# EAGLE design sx19_project_02_air_quality (EAGLE 9.6.2)
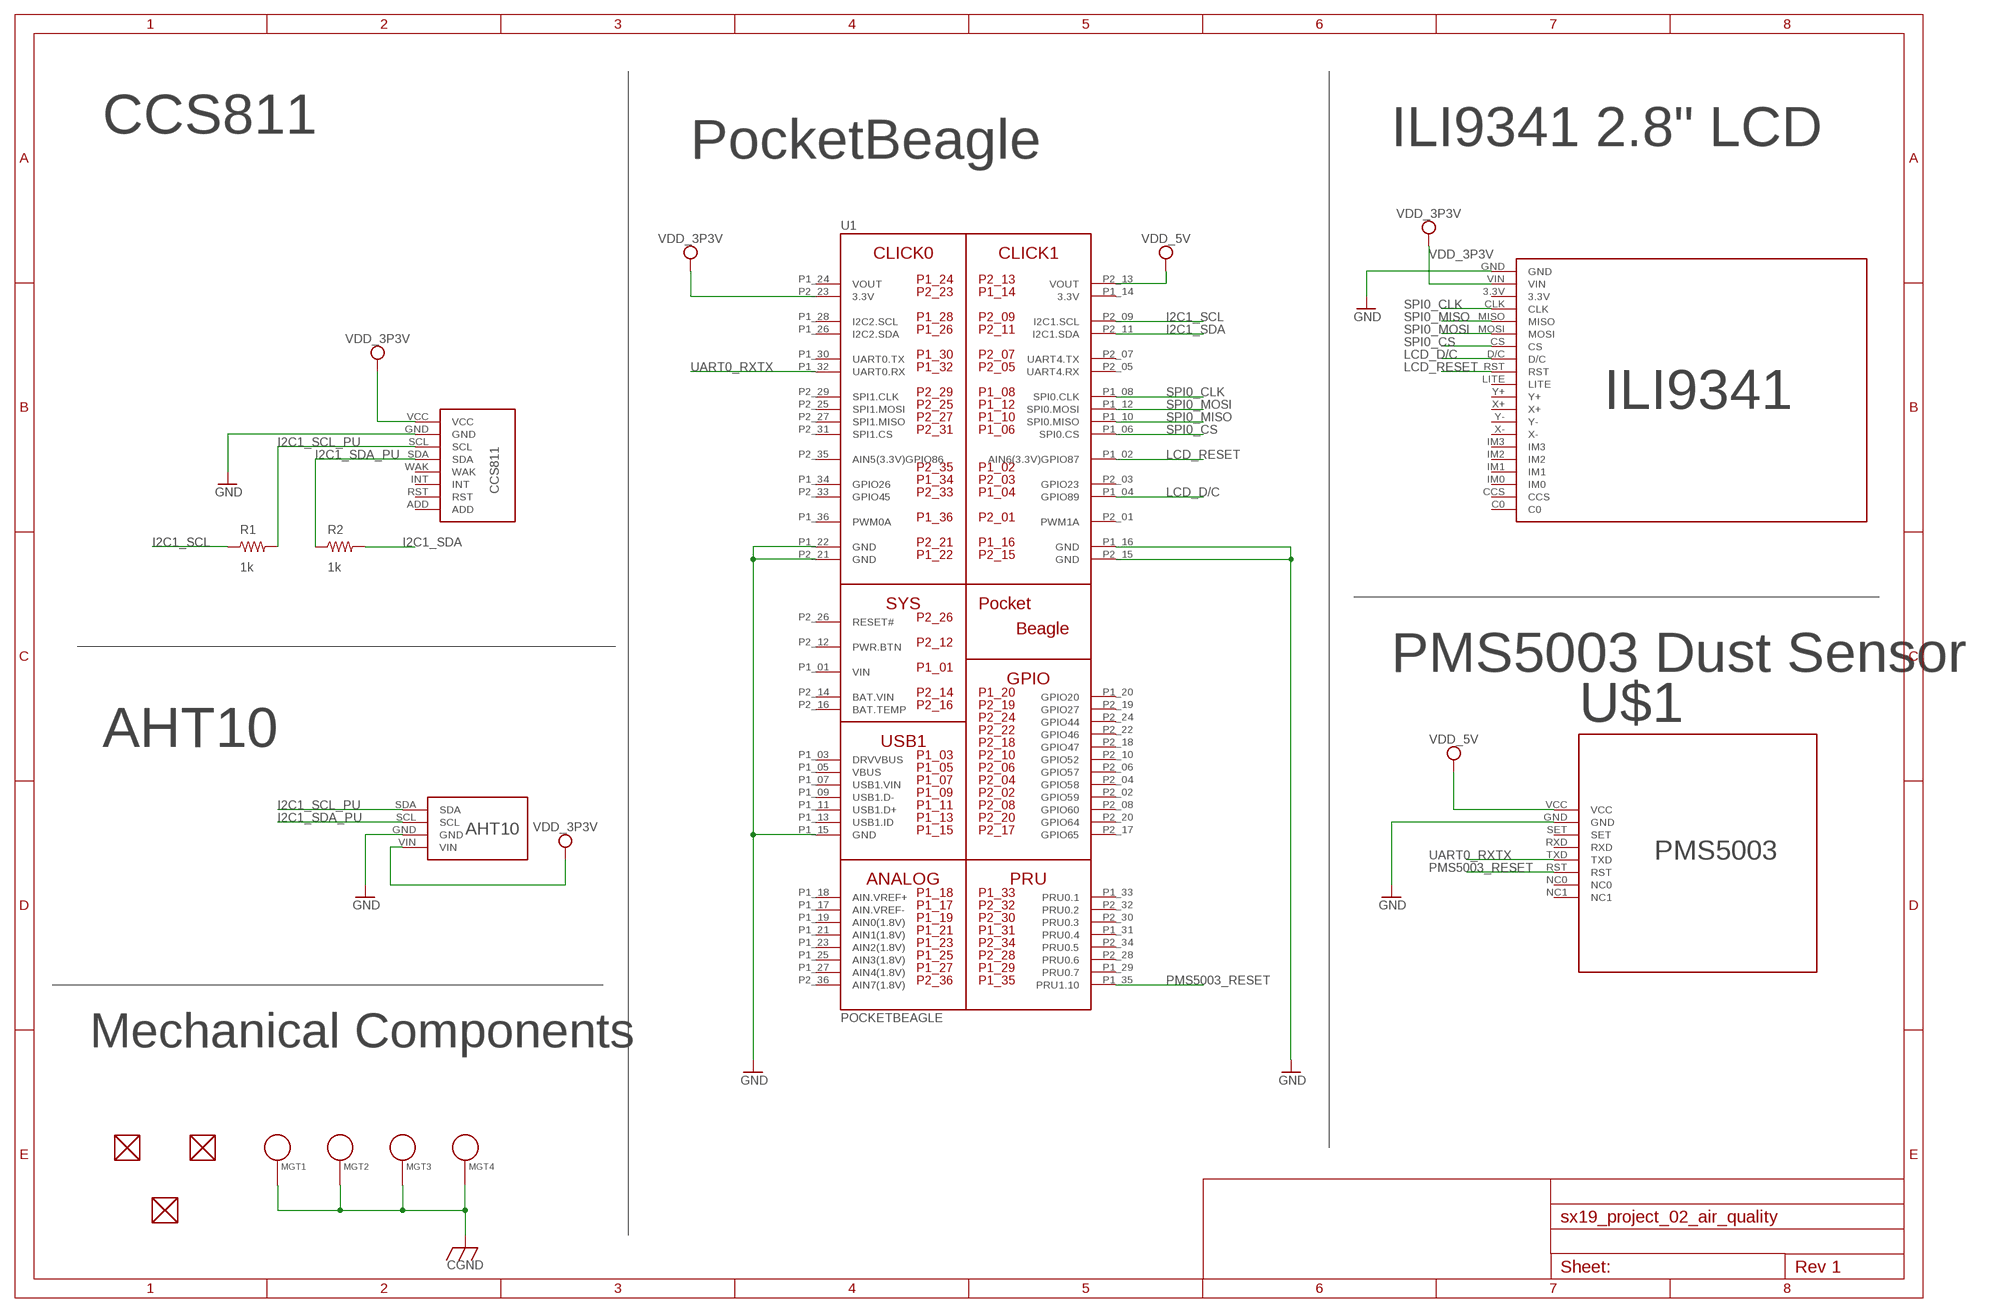
[diagram p0: schematic, sheet 1]

## Parts
B1  AHT10  [AHT10]
B2  CCS811  [CCS811]
B3  ILI9341  [ILI9341]
FUD1  FIDUCIAL  [FIDUCIAL_40MIL]
FUD2  FIDUCIAL  [FIDUCIAL_40MIL]
FUD3  FIDUCIAL  [FIDUCIAL_40MIL]
MGT1  MOUNTING_HOLE  [MOUNTING_HOLE]
MGT2  MOUNTING_HOLE  [MOUNTING_HOLE]
MGT3  MOUNTING_HOLE  [MOUNTING_HOLE]
MGT4  MOUNTING_HOLE  [MOUNTING_HOLE]
R1  1k  R_R0603  [R0603]
R2  1k  R_R0603  [R0603]
U1  POCKETBEAGLE  [POCKETBEAGLE]
U$1  PMS5003  [PMS5003]

## Nets
CGND: MGT1.P$1 MGT2.P$1 MGT3.P$1 MGT4.P$1
GND: B1.GND B2.GND B3.GND U1.P1_15(GND) U1.P1_16(GND) U1.P1_22(GND) U1.P2_15(GND) U1.P2_21(GND) U$1.GND
I2C1_SCL: R1.1 U1.P2_09(I2C1.SCL)
I2C1_SCL_PU: B1.SDA B2.SCL R1.2
I2C1_SDA: R2.2 U1.P2_11(I2C1.SDA)
I2C1_SDA_PU: B1.SCL B2.SDA R2.1
LCD_D/C: B3.D/C U1.P1_04(GPIO89)
LCD_RESET: B3.RST U1.P1_02(AIN6(3.3V)GPIO87)
PMS5003_RESET: U1.P1_35(PRU1.10) U$1.RST
SPI0_CLK: B3.CLK U1.P1_08(SPI0.CLK)
SPI0_CS: B3.CS U1.P1_06(SPI0.CS)
SPI0_MISO: B3.MISO U1.P1_10(SPI0.MISO)
SPI0_MOSI: B3.MOSI U1.P1_12(SPI0.MOSI)
UART0_RXTX: U1.P1_32(UART0.RX) U$1.TXD
VDD_3P3V: B1.VIN B2.VCC B3.VIN U1.P2_23(3.3V)
VDD_5V: U1.P2_13(VOUT) U$1.VCC
Unconnected: B2.ADD B2.INT B2.RST B2.WAK B3.3.3V B3.C0 B3.CCS B3.IM0 B3.IM1 B3.IM2 B3.IM3 B3.LITE B3.X+ B3.X- B3.Y+ B3.Y- FUD1.P$1 FUD2.P$1 FUD3.P$1 U1.P1_03(DRVVBUS) U1.P1_05(VBUS) U1.P1_07(USB1.VIN) U1.P1_09(USB1.D-) U1.P1_11(USB1.D+) U1.P1_13(USB1.ID) U1.P1_17(AIN.VREF-) U1.P1_18(AIN.VREF+) U1.P1_19(AIN0(1.8V)) U1.P1_20(GPIO20) U1.P1_21(AIN1(1.8V)) U1.P1_23(AIN2(1.8V)) U1.P1_25(AIN3(1.8V)) U1.P1_26(I2C2.SDA) U1.P1_27(AIN4(1.8V)) U1.P1_28(I2C2.SCL) U1.P1_29(PRU0.7) U1.P1_30(UART0.TX) U1.P1_31(PRU0.4) U1.P1_33(PRU0.1) U1.P1_34(GPIO26) U1.P1_36(PWM0A) U1.P2_01(PWM1A) U1.P2_02(GPIO59) U1.P2_03(GPIO23) U1.P2_04(GPIO58) U1.P2_05(UART4.RX) U1.P2_06(GPIO57) U1.P2_07(UART4.TX) U1.P2_08(GPIO60) U1.P2_10(GPIO52) U1.P2_12(PWR.BTN) U1.P2_16(BAT.TEMP) U1.P2_17(GPIO65) U1.P2_18(GPIO47) U1.P2_19(GPIO27) U1.P2_20(GPIO64) U1.P2_22(GPIO46) U1.P2_24(GPIO44) U1.P2_25(SPI1.MOSI) U1.P2_26(RESET#) U1.P2_27(SPI1.MISO) U1.P2_28(PRU0.6) U1.P2_29(SPI1.CLK) U1.P2_30(PRU0.3) U1.P2_31(SPI1.CS) U1.P2_32(PRU0.2) U1.P2_33(GPIO45) U1.P2_34(PRU0.5) U1.P2_35(AIN5(3.3V)GPIO86) U1.P2_36(AIN7(1.8V)) U$1.NC0 U$1.NC1 U$1.RXD U$1.SET

## Notes on the sheet
- CCS811 | ILI9341 2.8" LCD
- PocketBeagle
- PMS5003 Dust Sensor
- AHT10
- Mechanical Components

## Power pins joined to a net without a drawn wire
3.3V: U1.P1_14(3.3V)
BAT.VIN: U1.P2_14(BAT.VIN)
VIN: U1.P1_01(VIN)
VOUT: U1.P1_24(VOUT)

## Library data of the parts
B1 = project_02_lib:AHT10: Breakout board for the AHT10 integrated temperature and humidity sensor by Aosong (Asair) Electronics
B2 = project_02_lib:CCS811: CCS811 based a specific layout sold on Amazon. May be discontinued in favor of the Adafruit design.
B3 = project_02_lib:ILI9341: ILI9341 LCD based on the 2.8" Adafruit product
FUD1-FUD3 = project_02_lib:FIDUCIAL
MGT1-MGT4 = project_02_lib:MOUNTING_HOLE: Chassis Mounting Hole w/GND connection ability
R1 R2 = project_02_lib:R_: RESISTOR, American symbol
U1 = project_02_lib:POCKETBEAGLE
U$1 = project_02_lib:PMS5003: Breakout board of the PMS5003 by Plantower and distributed by Adafruit. Connects to the corresponding terminals on the PMS5003 dust sensor.

## Board
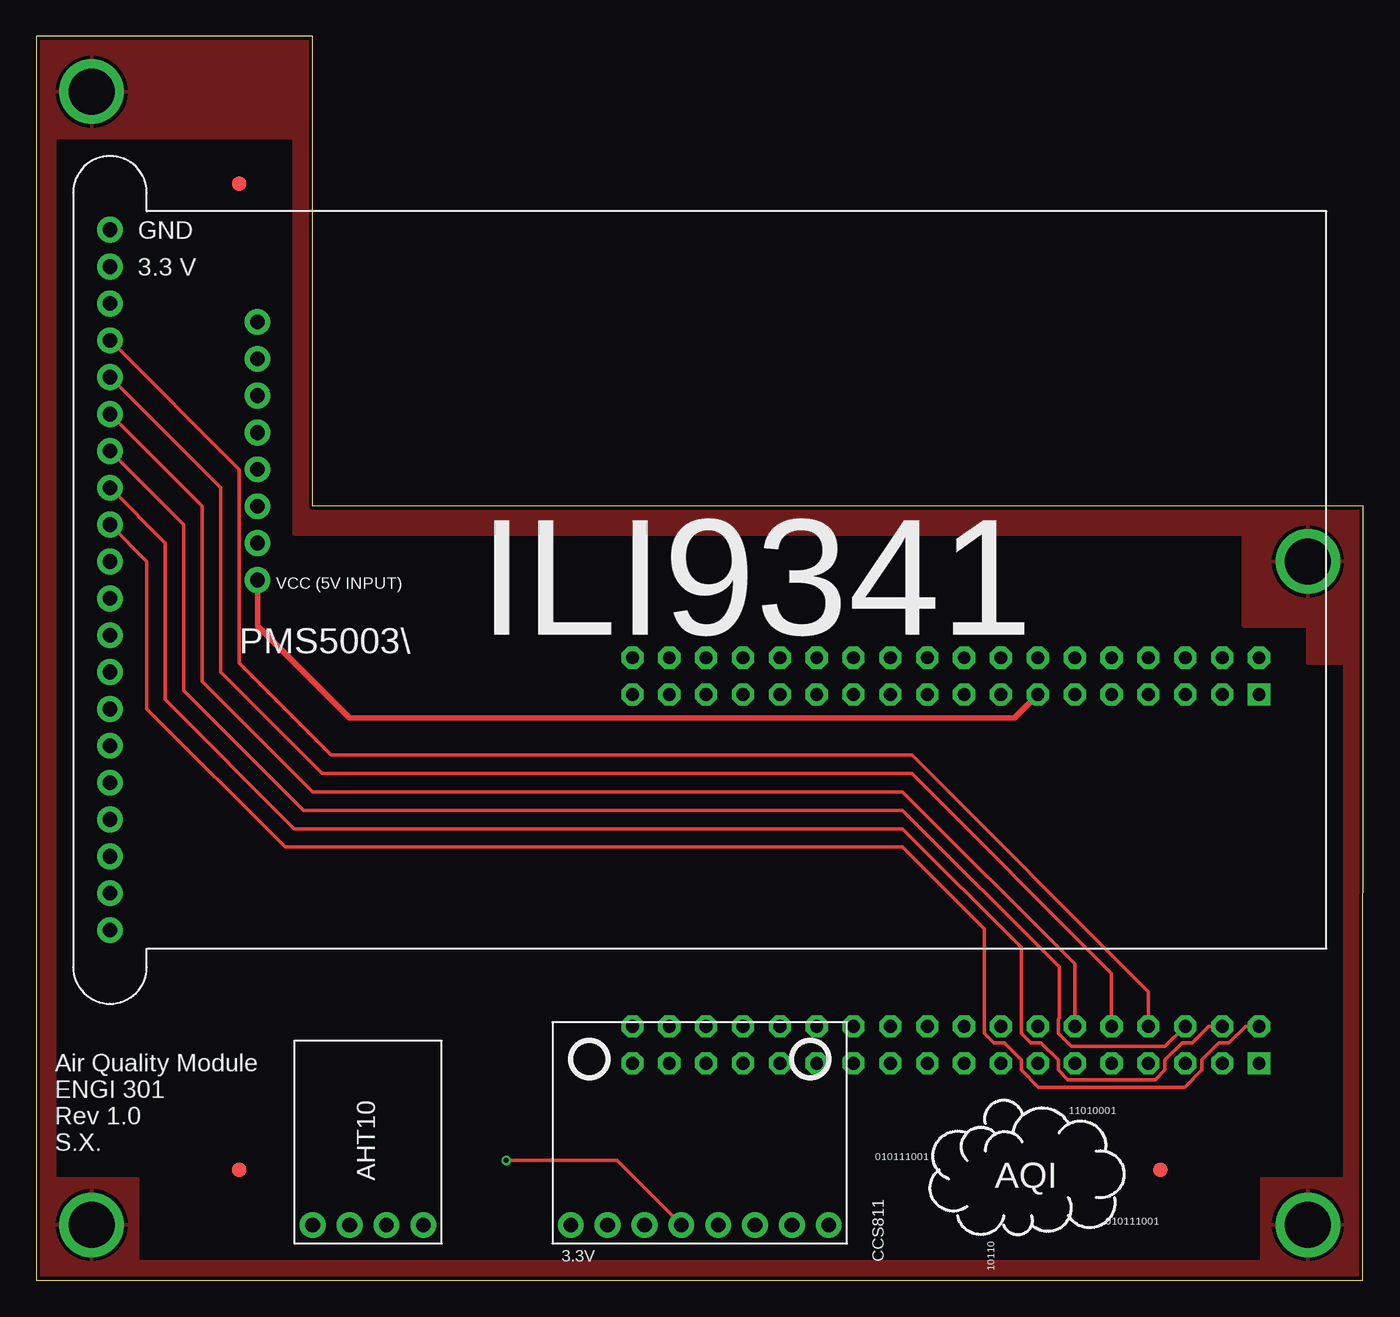
[diagram p1: board, top side]
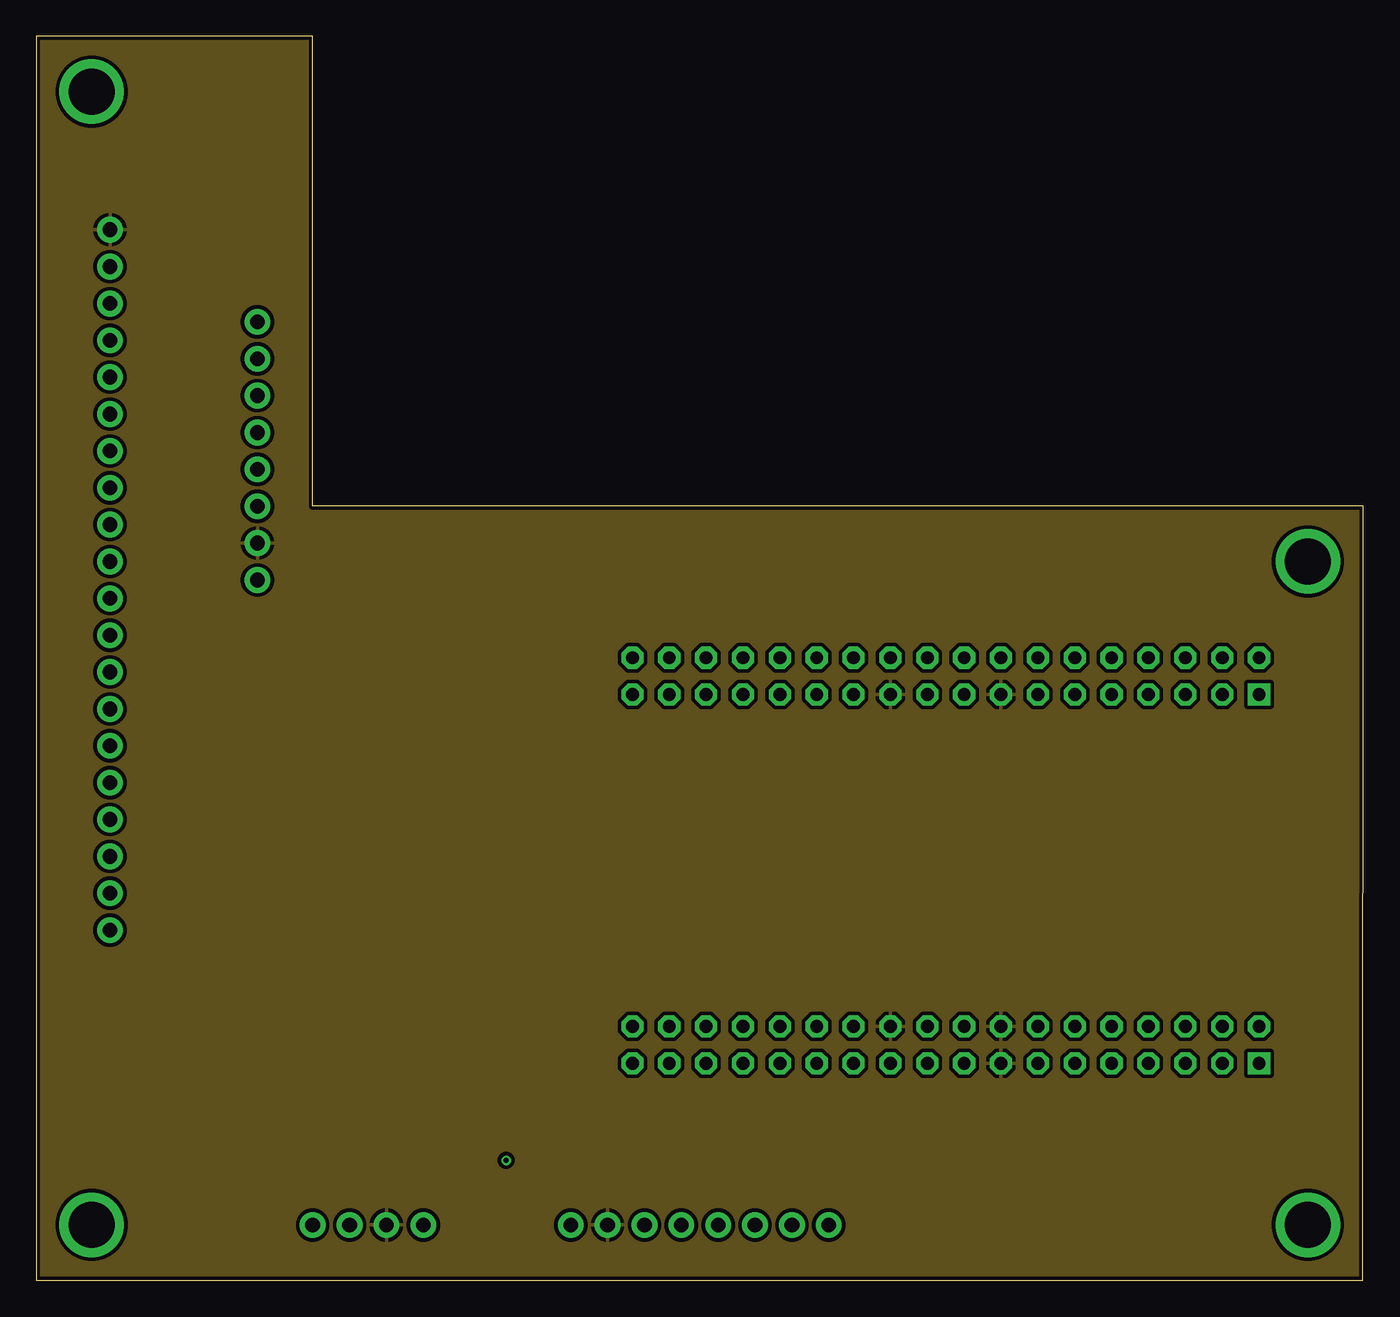
[diagram p2: board, inner layer Route2]
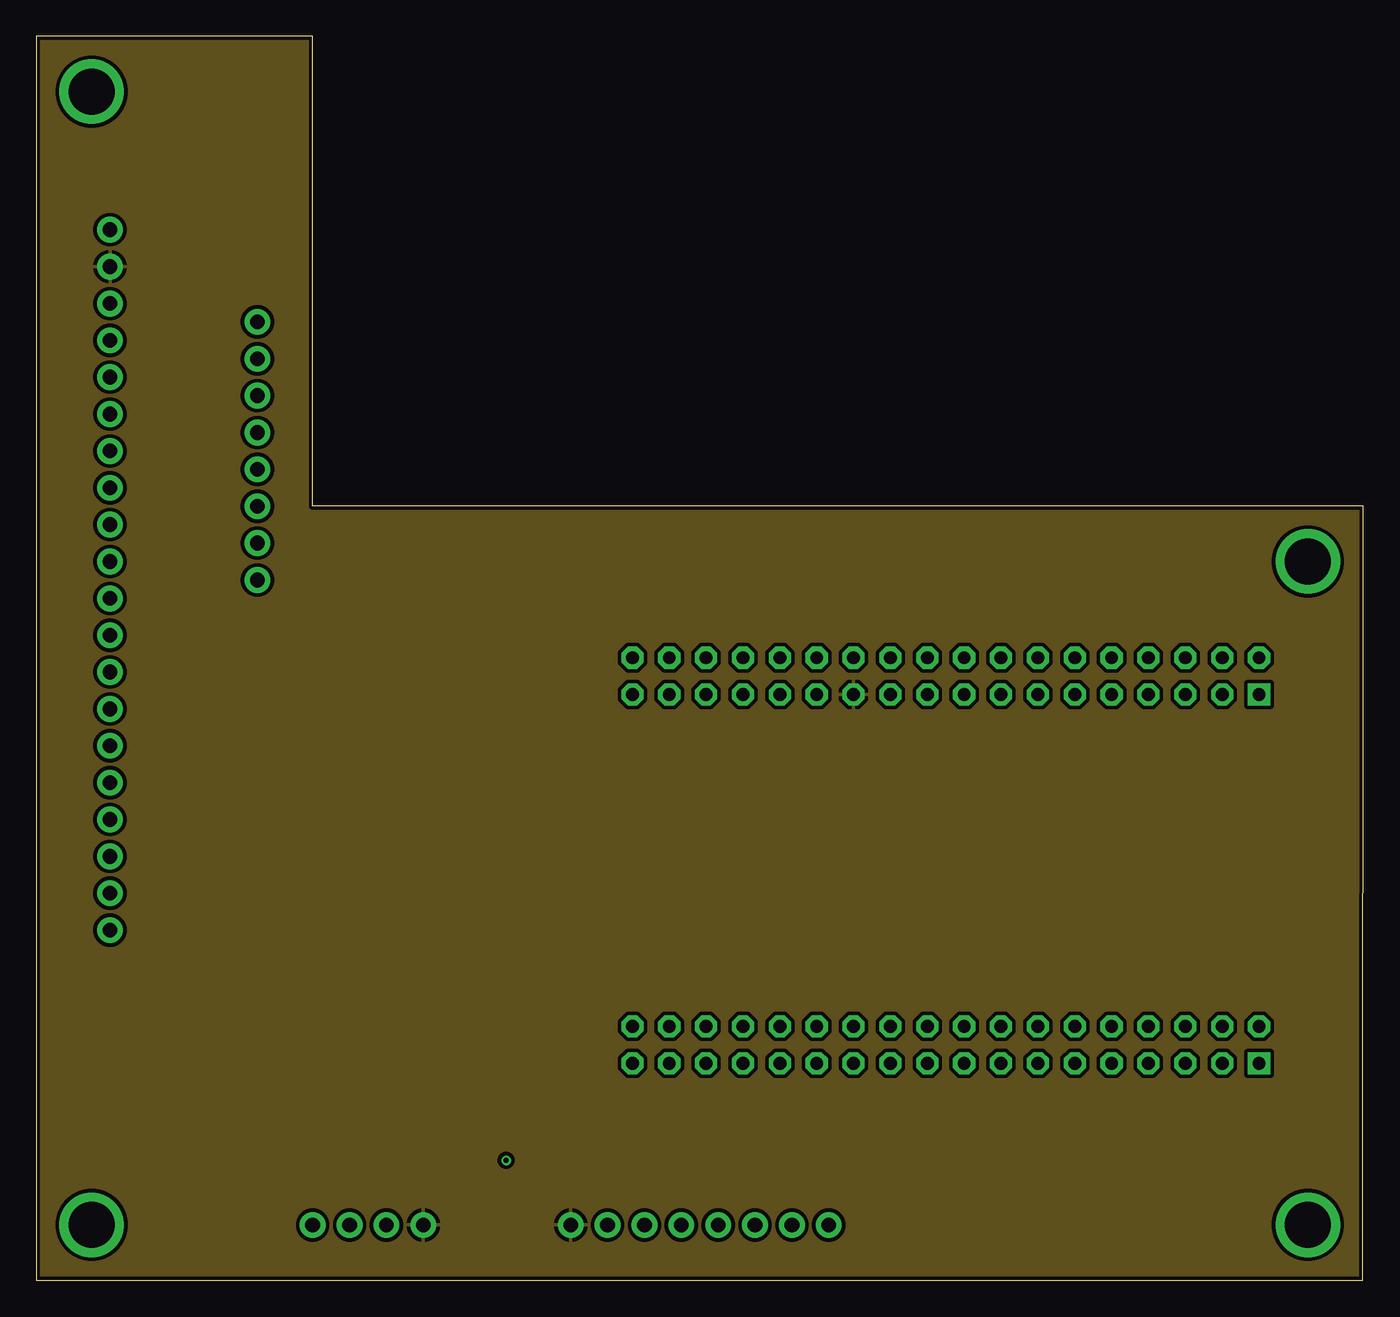
[diagram p3: board, inner layer Route15]
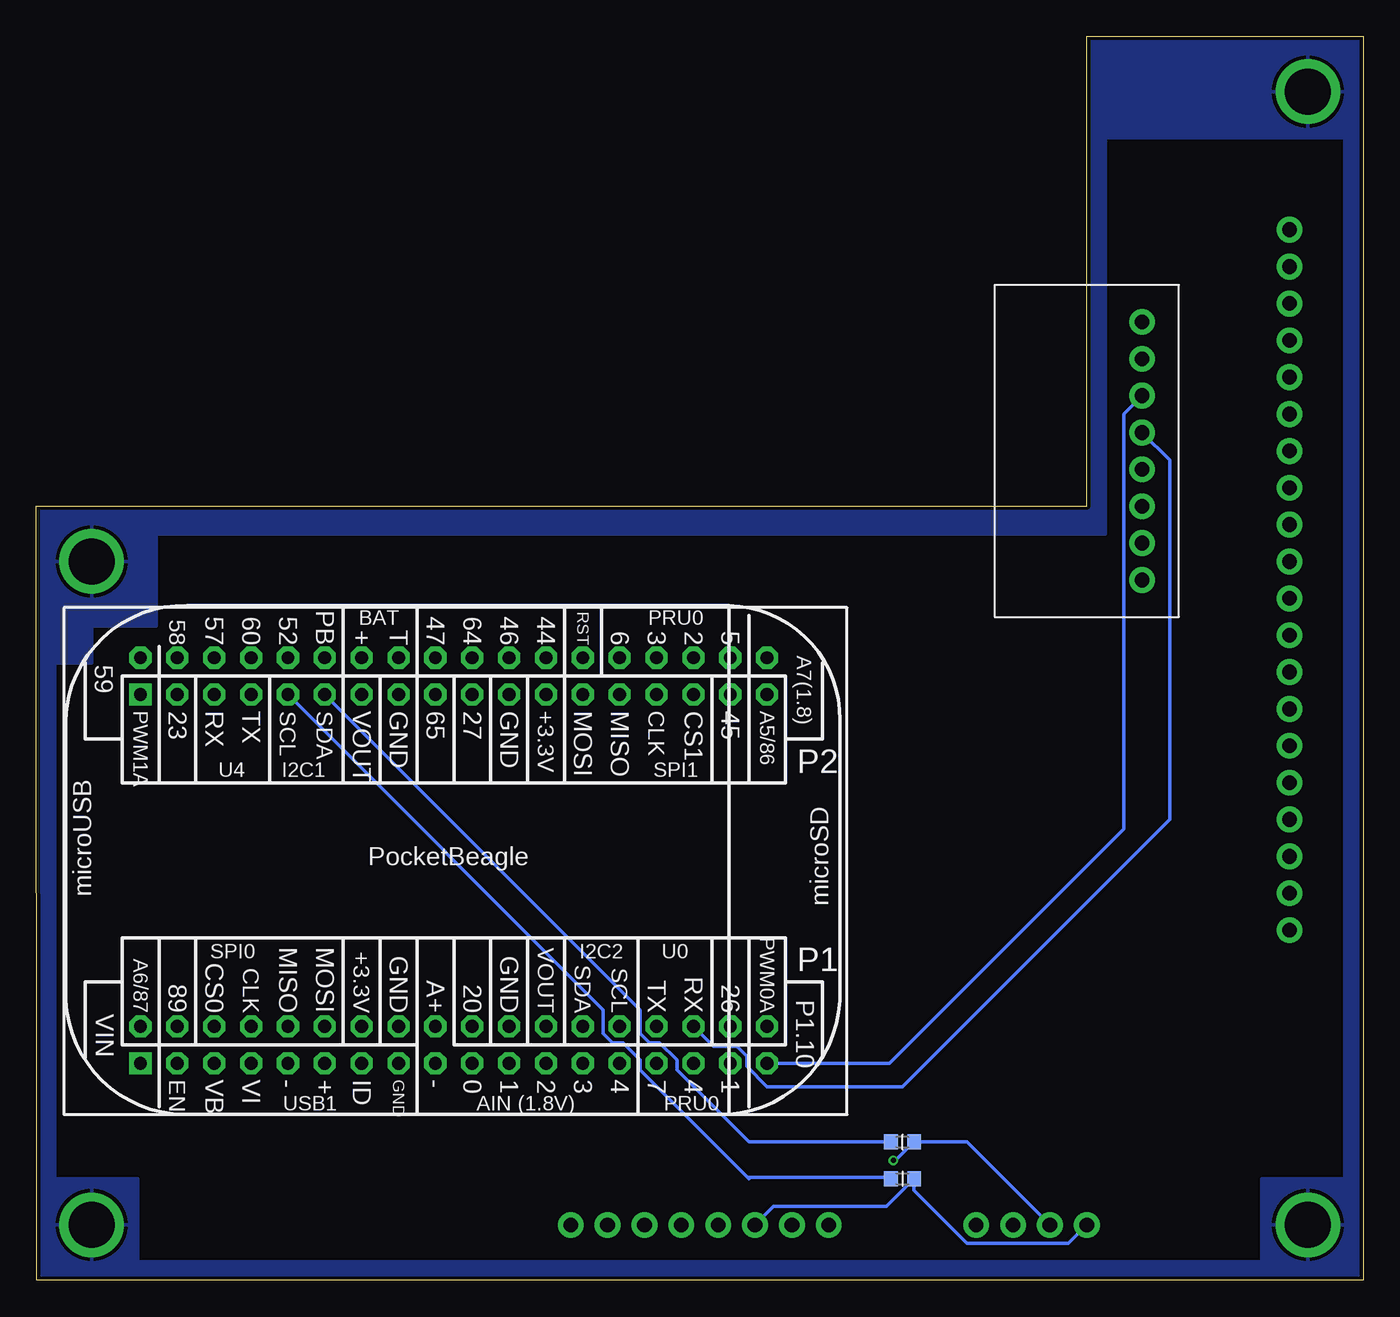
[diagram p4: board, bottom side, seen from below]

Size 91.44 x 85.72 mm. Coordinates in mm from the lower left corner, seen from the top.
Outline: 0,0 91.42,0 91.44,53.34 19.05,53.34 19.05,85.72 0,85.72 0,0
Copper layers (1*2*15*16): Top 0.035mm / dielectric 0.23mm / Route2 0.035mm / dielectric 0.93mm / Route15 0.035mm / dielectric 0.23mm / Bottom 0.035mm
Design rules "ENGI301_4lyr": minimum track width 10mil, minimum drill 12mil, track to track 10mil, track to pad 10mil, pad to pad 10mil, via to via 10mil, smd to smd 10mil, copper to edge 10mil, drill to drill 12mil, minimum pad ring 6mil, minimum via ring 6mil, stop-mask expansion 3mil, vias tented up to drill 25mil, thermal gap 10mil

### Footprints (pad centres in the part's own frame; a part is rotated, then mirrored left to right if it is on the bottom)
AHT10 = drill 1.016 pad 1.778: GND 0,-5.08; SCL 0,-2.54; SDA 0,0; VIN 0,-7.62
CCS811 = drill 1.016 pad 1.778: ADD 0,-17.78; GND 0,-2.54; INT 0,-12.7; RST 0,-15.24; SCL 0,-5.08; SDA 0,-7.62; VCC 0,0; WAK 0,-10.16
ILI9341 = drill 1.016 pad 1.778: 3.3V 0,-5.08; C0 0,-48.26; CCS 0,-45.72; CLK 0,-7.62; CS 0,-15.24; D/C 0,-17.78; GND 0,0; IM0 0,-43.18; IM1 0,-40.64; IM2 0,-38.1; IM3 0,-35.56; LITE 0,-22.86; MISO 0,-10.16; MOSI 0,-12.7; RST 0,-20.32; VIN 0,-2.54; X+ 0,-27.94; X- 0,-33.02; Y+ 0,-25.4; Y- 0,-30.48
FIDUCIAL_40MIL = smd 1.016 x 1.016: P$1 0,0
MOUNTING_HOLE = drill 3.175 pad 4.445: P$1 0,0
R0603 = smd 0.95 x 1.031: 1 -0.8,0; 2 0.8,0
POCKETBEAGLE = drill 0.889 pad 1.524 square: P1_01 5.91,3.53; P2_01 5.91,28.93 | drill 0.889 pad 1.524 octagon: P1_02 5.91,6.07; P1_03 8.45,3.53; P1_04 8.45,6.07; P1_05 10.99,3.53; P1_06 10.99,6.07; P1_07 13.53,3.53; P1_08 13.53,6.07; P1_09 16.07,3.53; P1_10 16.07,6.07; P1_11 18.61,3.53; P1_12 18.61,6.07; P1_13 21.15,3.53; P1_14 21.15,6.07; P1_15 23.69,3.53; P1_16 23.69,6.07; P1_17 26.23,3.53; P1_18 26.23,6.07; P1_19 28.77,3.53; P1_20 28.77,6.07; P1_21 31.31,3.53; P1_22 31.31,6.07; P1_23 33.85,3.53; P1_24 33.85,6.07; P1_25 36.39,3.53; P1_26 36.39,6.07; P1_27 38.93,3.53; P1_28 38.93,6.07; P1_29 41.47,3.53; P1_30 41.47,6.07; P1_31 44.01,3.53; P1_32 44.01,6.07; P1_33 46.55,3.53; P1_34 46.55,6.07; P1_35 49.09,3.53; P1_36 49.09,6.07; P2_02 5.91,31.47; P2_03 8.45,28.93; P2_04 8.45,31.47; P2_05 10.99,28.93; P2_06 10.99,31.47; P2_07 13.53,28.93; P2_08 13.53,31.47; P2_09 16.07,28.93; P2_10 16.07,31.47; P2_11 18.61,28.93; P2_12 18.61,31.47; P2_13 21.15,28.93; P2_14 21.15,31.47; P2_15 23.69,28.93; P2_16 23.69,31.47; P2_17 26.23,28.93; P2_18 26.23,31.47; P2_19 28.77,28.93; P2_20 28.77,31.47; P2_21 31.31,28.93; P2_22 31.31,31.47; P2_23 33.85,28.93; P2_24 33.85,31.47; P2_25 36.39,28.93; P2_26 36.39,31.47; P2_27 38.93,28.93; P2_28 38.93,31.47; P2_29 41.47,28.93; P2_30 41.47,31.47; P2_31 44.01,28.93; P2_32 44.01,31.47; P2_33 46.55,28.93; P2_34 46.55,31.47; P2_35 49.09,28.93; P2_36 49.09,31.47
PMS5003 = drill 1.016 pad 1.778: GND 0,-2.54; NC0 0,-15.24; NC1 0,-17.78; RST 0,-12.7; RXD 0,-7.62; SET 0,-5.08; TXD 0,-10.16; VCC 0,0

### Placement (x,y rotation side)
B1  19.05,3.81 90 top
B2  36.83,3.81 90 top
B3  5.08,72.39 0 top
FUD1  13.97,7.62 0 top
FUD2  77.47,7.62 0 top
FUD3  13.97,75.56 0 top
MGT1  3.81,3.81 0 top
MGT2  87.63,3.81 0 top
MGT3  87.63,49.53 0 top
MGT4  3.81,81.92 0 top
R1  31.75,6.99 0 bottom
R2  31.75,9.53 180 bottom
U1  90.17,11.43 0 bottom
U$1  15.24,48.26 180 bottom

### Tracks (layer width: path | path; a pad name or v marks a point on that pad's centre or on a via)
CGND
  pour Top: -1.27,42.55 -1.27,87 20.95,87 20.95,54.61 92.71,54.61 92.71,42.55 87.63,42.55 87.63,45.09 83.19,45.09 83.19,51.44 17.78,51.44 17.78,78.74 1.27,78.74 1.27,42.55
  pour Top: -1.27,42.55 1.27,42.55 1.27,6.99 6.99,6.99 6.99,1.27 84.45,1.27 84.45,6.99 90.17,6.99 90.17,42.55 92.71,42.55 92.71,-1.27 -1.27,-1.27
  pour Bottom: -1.27,87 -1.27,47.62 1.27,47.62 1.27,78.74 17.78,78.74 17.78,51.44 83.19,51.44 83.19,45.09 87.63,45.09 87.63,42.55 90.17,42.55 91.44,42.55 93.34,42.55 93.34,55.24 20.32,55.24 20.32,87
  pour Bottom: -1.27,47.62 1.27,47.62 1.27,6.99 6.99,6.99 6.99,1.27 84.45,1.27 84.45,6.99 90.17,6.99 90.17,42.55 92.71,42.55 92.71,-1.27 -0.64,-1.27 -1.27,-1.27
GND
  pour Route2: 93.98,88.27 93.98,-2.54 -2.54,-2.54 -2.54,88.27
I2C1_SCL
  Bottom 0.254: U1.P2_09 52.38,18.64 52.38,17.03 51.71,16.36 51.02,16.36 49.84,15.18 49.84,14.49 42.44,7.09 | 42.44,7.09 42.34,6.99 | 42.44,7.09 32.65,7.09 R1.1
I2C1_SCL_PU
  Bottom 0.254: B2.SCL 40.64,5.08 32.85,5.08 R1.2 30.95,6.18 27.3,2.54 20.32,2.54 B1.SDA
I2C1_SDA
  Bottom 0.254: U1.P2_11 49.84,18.64 49.84,17.03 49.17,16.36 48.48,16.36 47.3,15.18 47.3,14.49 42.34,9.53 R2.2
I2C1_SDA_PU  (via drill 0.35)
  Top 0.254: B2.SDA 40.01,8.26 v32.38,8.26
  Bottom 0.254: B1.SCL 27.3,9.53 R2.1 32.22,8.26 v32.38,8.26
LCD_D/C
  Top 0.254: U1.P1_04 80.8,17.5 79.65,16.36 78.96,16.36 77.78,15.18 77.78,14.49 77.11,13.82 71.09,13.82 70.42,14.49 70.42,15.18 69.24,16.36 68.55,16.36 67.88,17.03 67.88,22.93 59.69,31.11 17.78,31.11 8.89,40.01 8.89,50.8 B3.D/C
LCD_RESET
  Top 0.254: U1.P1_02 83.34,17.5 82.19,16.36 81.5,16.36 80.32,15.18 80.32,14.49 79.14,13.31 69.06,13.31 67.88,14.49 67.88,15.18 66.7,16.36 66.01,16.36 65.34,17.03 65.34,24.2 59.69,29.84 17.14,29.84 7.62,39.37 7.62,49.53 B3.RST
PMS5003_RESET
  Bottom 0.254: U1.P1_35 32.66,14.96 16.51,31.11 16.51,59.69 U$1.RST
SPI0_CLK
  Top 0.254: B3.CLK 13.97,55.88 13.97,42.55 20.32,36.2 60.33,36.2 76.64,19.88 U1.P1_08
SPI0_CS
  Top 0.254: B3.CS 10.16,52.07 10.16,40.64 18.41,32.38 59.69,32.38 70.48,21.59 70.48,18.04 70.42,17.97 70.42,17.03 71.34,16.1 77.78,16.1 U1.P1_06
SPI0_MISO
  Top 0.254: B3.MISO 12.7,54.61 12.7,41.91 19.68,34.92 60.33,34.92 74.1,21.15 U1.P1_10
SPI0_MOSI
  Top 0.254: B3.MOSI 11.43,53.34 11.43,41.27 19.05,33.66 59.69,33.66 71.56,21.79 U1.P1_12
UART0_RXTX
  Bottom 0.254: U$1.TXD 13.34,56.52 13.34,31.75 31.75,13.34 41.07,13.34 42.48,14.74 42.48,15.43 43.15,16.1 44.76,16.1 U1.P1_32
VDD_3P3V
  pour Route15: -5.08,90.81 96.75,90.81 96.75,-5.08 -5.08,-5.08
VDD_5V
  Top 0.381: U1.P2_13 67.39,38.73 21.59,38.73 15.24,45.09 U$1.VCC

### Text on the board
tPlace: 11010001 | Air Quality Module / ENGI 301 / Rev 1.0 / S.X. | 010111001 | AQI | 010111001 | 3.3V | 10110
tNames: GND | 3.3 V | VCC (5V INPUT) | PMS5003\